# Altium project 0027.PrjPcb
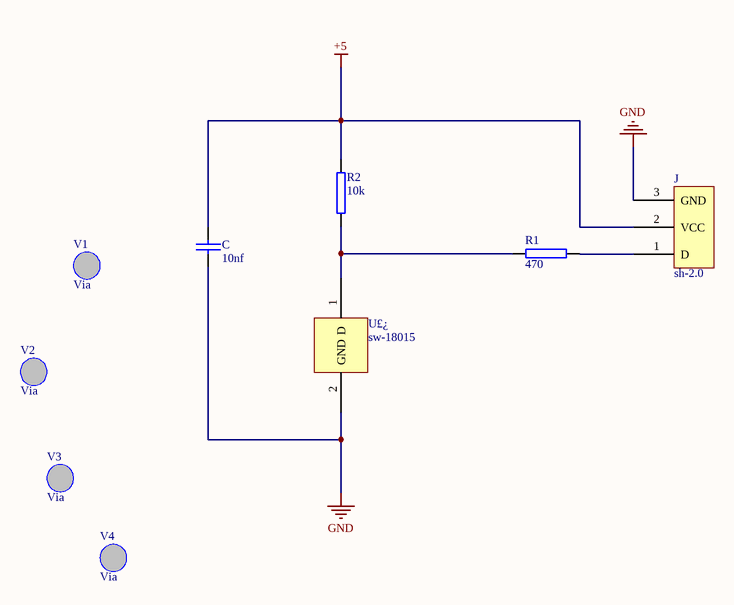
[diagram p0: 0027.SchDoc]
1 sheet, 9 parts. Net scope: global (net labels, ports and power ports of the same name join across sheets).
Board file: 0027.PcbDoc

## Sheet 0027.SchDoc
size A4

### Parts
C  10nf  [0402]
J  sh-2.0  [sh-2.0]
R1  470  [0402]
R2  10k  [0402]
U£¿  sw-18015  [sw-18015]
V1  Via  [Via]
V2  Via  [Via]
V3  Via  [Via]
V4  Via  [Via]

### Nets
+5: C.1 J.2(VCC) R2.2
GND: C.2 J.3(GND) U£¿.2(GND)
NetJ_1: J.1(D) R1.2
NetR1_1: R1.1 R2.1 U£¿.1(D)

### Library data of the parts
C = CAP0402
R1 R2 = RES0402